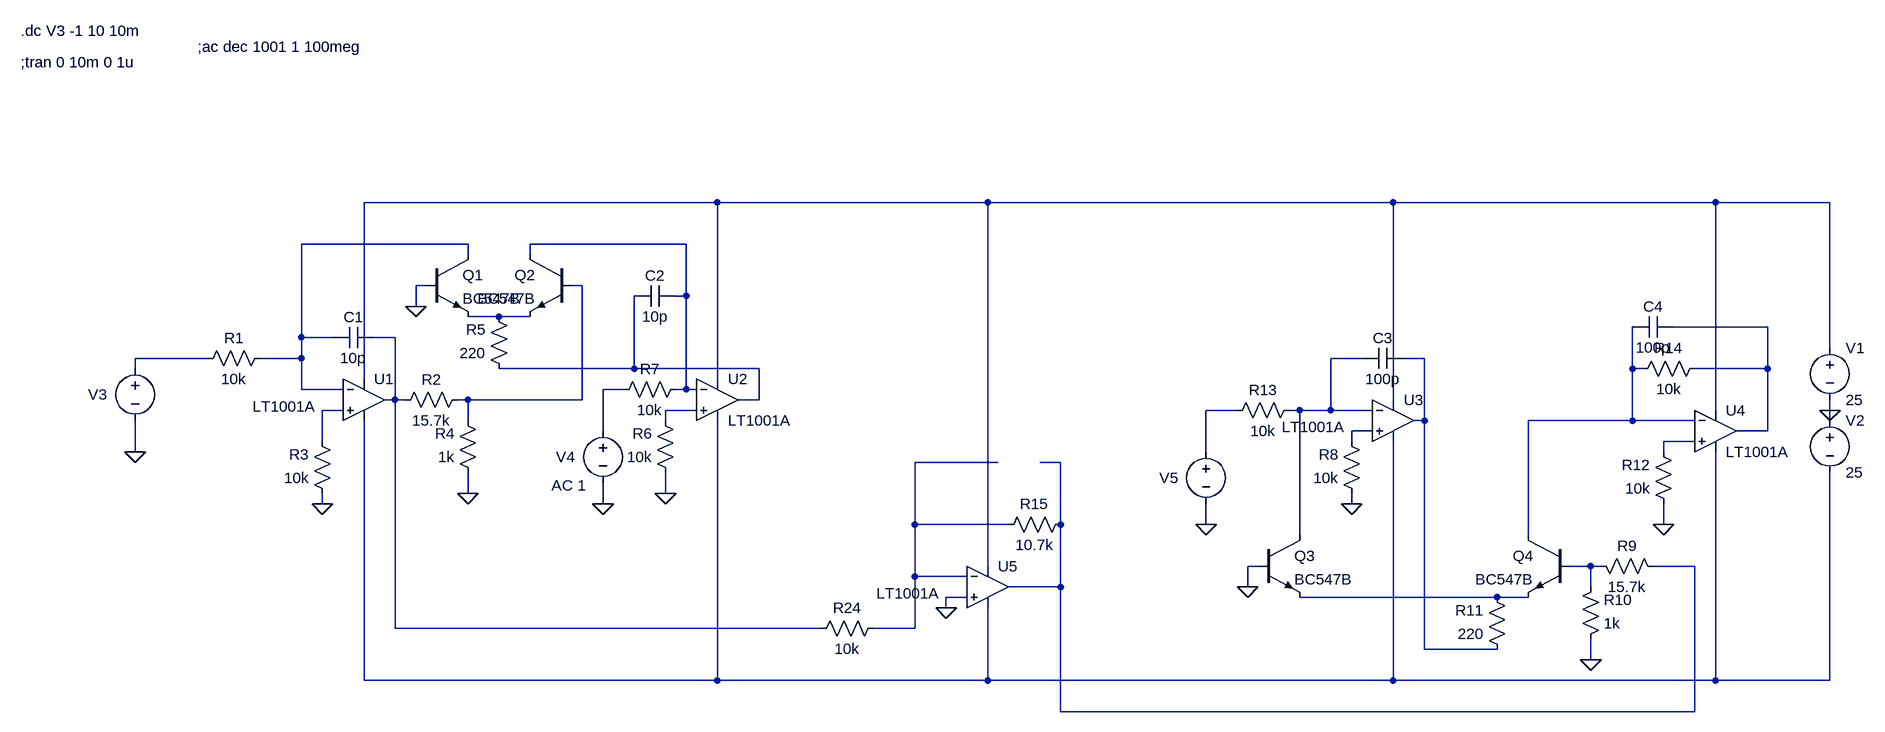
[diagram p0: schematic logTransistors.asc]
logTransistors.asc, the LTspice schematic file:
Version 4
SHEET 1 2636 680
WIRE 864 -192 320 -192
WIRE 1280 -192 864 -192
WIRE 1904 -192 1280 -192
WIRE 2400 -192 1904 -192
WIRE 2576 -192 2400 -192
WIRE 480 -128 224 -128
WIRE 816 -128 576 -128
WIRE 480 -112 480 -128
WIRE 576 -112 576 -128
WIRE 416 -64 400 -64
WIRE 656 -64 640 -64
WIRE 816 -48 816 -128
WIRE 816 -48 800 -48
WIRE 400 -32 400 -64
WIRE 528 -16 480 -16
WIRE 576 -16 528 -16
WIRE 2480 0 2336 0
WIRE 224 16 224 -128
WIRE 272 16 224 16
WIRE 368 16 336 16
WIRE 2576 32 2576 -192
WIRE 80 48 -32 48
WIRE 224 48 224 16
WIRE 224 48 160 48
WIRE 1856 48 1808 48
WIRE 1952 48 1920 48
WIRE -32 64 -32 48
WIRE 736 64 736 -48
WIRE 736 64 528 64
WIRE 928 64 736 64
WIRE 2272 64 2272 0
WIRE 2288 64 2272 64
WIRE 2480 64 2480 0
WIRE 2480 64 2368 64
WIRE 320 80 320 -192
WIRE 864 80 864 -192
WIRE 224 96 224 48
WIRE 288 96 224 96
WIRE 720 96 688 96
WIRE 816 96 816 -48
WIRE 816 96 800 96
WIRE 832 96 816 96
WIRE 368 112 368 16
WIRE 368 112 352 112
WIRE 384 112 368 112
WIRE 480 112 464 112
WIRE 656 112 656 -64
WIRE 656 112 480 112
WIRE 928 112 928 64
WIRE 928 112 896 112
WIRE 1904 112 1904 -192
WIRE 288 128 256 128
WIRE 832 128 784 128
WIRE 1664 128 1616 128
WIRE 1760 128 1744 128
WIRE 1808 128 1808 48
WIRE 1808 128 1760 128
WIRE 1872 128 1808 128
WIRE 2400 128 2400 -192
WIRE 2576 128 2576 112
WIRE 480 144 480 112
WIRE 784 144 784 128
WIRE 1952 144 1952 48
WIRE 1952 144 1936 144
WIRE 2272 144 2272 64
WIRE 2272 144 2112 144
WIRE 2368 144 2272 144
WIRE 2576 144 2576 128
WIRE 688 160 688 96
WIRE 1872 160 1840 160
WIRE 2480 160 2480 64
WIRE 2480 160 2432 160
WIRE 256 176 256 128
WIRE 1840 176 1840 160
WIRE 2368 176 2320 176
WIRE -32 192 -32 144
WIRE 1616 192 1616 128
WIRE 2320 192 2320 176
WIRE 1296 208 1168 208
WIRE 1392 208 1360 208
WIRE 480 256 480 224
WIRE 784 256 784 224
WIRE 256 272 256 256
WIRE 688 272 688 240
WIRE 1840 272 1840 256
WIRE 1168 304 1168 208
WIRE 1312 304 1168 304
WIRE 1392 304 1392 208
WIRE 1616 304 1616 272
WIRE 2320 304 2320 272
WIRE 1760 320 1760 128
WIRE 2112 320 2112 144
WIRE 1280 368 1280 -192
WIRE 1696 368 1680 368
WIRE 2208 368 2176 368
WIRE 2224 368 2208 368
WIRE 2368 368 2304 368
WIRE 1168 384 1168 304
WIRE 1248 384 1168 384
WIRE 1392 400 1392 304
WIRE 1392 400 1312 400
WIRE 1680 400 1680 368
WIRE 2208 400 2208 368
WIRE 1248 416 1216 416
WIRE 2064 416 1760 416
WIRE 2112 416 2064 416
WIRE 1216 432 1216 416
WIRE 368 464 368 112
WIRE 1024 464 368 464
WIRE 1168 464 1168 384
WIRE 1168 464 1104 464
WIRE 1952 496 1952 144
WIRE 2064 496 1952 496
WIRE 2208 512 2208 480
WIRE 320 544 320 144
WIRE 864 544 864 144
WIRE 864 544 320 544
WIRE 1280 544 1280 432
WIRE 1280 544 864 544
WIRE 1904 544 1904 176
WIRE 1904 544 1280 544
WIRE 2400 544 2400 192
WIRE 2400 544 1904 544
WIRE 2576 544 2576 224
WIRE 2576 544 2400 544
WIRE 1392 592 1392 400
WIRE 2368 592 2368 368
WIRE 2368 592 1392 592
FLAG -32 192 0
FLAG 256 272 0
FLAG 2576 128 0
FLAG 480 256 0
FLAG 784 256 0
FLAG 688 272 0
FLAG 400 -32 0
FLAG 1840 272 0
FLAG 2208 512 0
FLAG 2320 304 0
FLAG 1616 304 0
FLAG 1680 400 0
FLAG 1216 432 0
SYMBOL res 272 272 R180
WINDOW 0 36 76 Left 2
WINDOW 3 36 40 Left 2
SYMATTR InstName R3
SYMATTR Value 10k
SYMBOL voltage 2576 16 R0
WINDOW 123 0 0 Left 2
WINDOW 39 0 0 Left 2
SYMATTR InstName V1
SYMATTR Value 25
SYMBOL voltage 2576 128 R0
WINDOW 123 0 0 Left 2
WINDOW 39 0 0 Left 2
SYMATTR InstName V2
SYMATTR Value 25
SYMBOL Opamps\\LT1001A 320 48 R0
WINDOW 3 -171 74 Left 2
SYMATTR InstName U1
SYMBOL voltage -32 48 R0
WINDOW 0 -72 56 Left 2
WINDOW 3 -301 -26 Invisible 2
WINDOW 123 -79 100 Left 2
WINDOW 39 0 0 Left 2
SYMATTR InstName V3
SYMATTR Value 1
SYMBOL res 176 32 R90
WINDOW 0 0 56 VBottom 2
WINDOW 3 32 56 VTop 2
SYMATTR InstName R1
SYMATTR Value 10k
SYMBOL Opamps\\LT1001A 864 48 R0
SYMATTR InstName U2
SYMBOL npn 416 -112 R0
SYMATTR InstName Q1
SYMATTR Value BC547B
SYMBOL res 480 96 R90
WINDOW 0 0 56 VBottom 2
WINDOW 3 32 56 VTop 2
SYMATTR InstName R2
SYMATTR Value 15.7k
SYMBOL res 496 240 R180
WINDOW 0 36 76 Left 2
WINDOW 3 36 40 Left 2
SYMATTR InstName R4
SYMATTR Value 1k
SYMBOL npn 640 -112 M0
SYMATTR InstName Q2
SYMATTR Value BC547B
SYMBOL res 544 80 R180
WINDOW 0 36 76 Left 2
WINDOW 3 36 40 Left 2
SYMATTR InstName R5
SYMATTR Value 220
SYMBOL res 800 240 R180
WINDOW 0 36 76 Left 2
WINDOW 3 36 40 Left 2
SYMATTR InstName R6
SYMATTR Value 10k
SYMBOL voltage 688 144 R0
WINDOW 0 -72 56 Left 2
WINDOW 3 -301 -26 Invisible 2
WINDOW 123 -79 100 Left 2
WINDOW 39 0 0 Left 2
SYMATTR InstName V4
SYMATTR Value 1
SYMATTR Value2 AC 1
SYMBOL res 816 80 R90
WINDOW 0 0 56 VBottom 2
WINDOW 3 32 56 VTop 2
SYMATTR InstName R7
SYMATTR Value 10k
SYMBOL cap 336 0 R90
WINDOW 0 0 32 VBottom 2
WINDOW 3 32 32 VTop 2
SYMATTR InstName C1
SYMATTR Value 10p
SYMBOL cap 800 -64 R90
WINDOW 0 0 32 VBottom 2
WINDOW 3 32 32 VTop 2
SYMATTR InstName C2
SYMATTR Value 10p
SYMBOL res 1856 272 R180
WINDOW 0 36 76 Left 2
WINDOW 3 36 40 Left 2
SYMATTR InstName R8
SYMATTR Value 10k
SYMBOL Opamps\\LT1001A 1904 80 R0
WINDOW 3 -171 74 Left 2
SYMATTR InstName U3
SYMBOL Opamps\\LT1001A 2400 96 R0
SYMATTR InstName U4
SYMBOL npn 1696 320 R0
SYMATTR InstName Q3
SYMATTR Value BC547B
SYMBOL res 2208 352 M90
WINDOW 0 0 56 VBottom 2
WINDOW 3 32 56 VTop 2
SYMATTR InstName R9
SYMATTR Value 15.7k
SYMBOL res 2192 496 M180
WINDOW 0 36 76 Left 2
WINDOW 3 36 40 Left 2
SYMATTR InstName R10
SYMATTR Value 1k
SYMBOL npn 2176 320 M0
SYMATTR InstName Q4
SYMATTR Value BC547B
SYMBOL res 2080 512 R180
WINDOW 0 36 76 Left 2
WINDOW 3 36 40 Left 2
SYMATTR InstName R11
SYMATTR Value 220
SYMBOL res 2336 288 R180
WINDOW 0 36 76 Left 2
WINDOW 3 36 40 Left 2
SYMATTR InstName R12
SYMATTR Value 10k
SYMBOL voltage 1616 176 R0
WINDOW 0 -72 56 Left 2
WINDOW 3 -301 -26 Invisible 2
WINDOW 123 -79 100 Left 2
WINDOW 39 0 0 Left 2
SYMATTR InstName V5
SYMATTR Value 1
SYMBOL res 1760 112 R90
WINDOW 0 0 56 VBottom 2
WINDOW 3 32 56 VTop 2
SYMATTR InstName R13
SYMATTR Value 10k
SYMBOL cap 1920 32 R90
WINDOW 0 0 32 VBottom 2
WINDOW 3 32 32 VTop 2
SYMATTR InstName C3
SYMATTR Value 100p
SYMBOL cap 2336 -16 R90
WINDOW 0 0 32 VBottom 2
WINDOW 3 32 32 VTop 2
SYMATTR InstName C4
SYMATTR Value 100p
SYMBOL res 2384 48 R90
WINDOW 0 0 56 VBottom 2
WINDOW 3 32 56 VTop 2
SYMATTR InstName R14
SYMATTR Value 10k
SYMBOL Opamps\\LT1001A 1280 336 R0
WINDOW 3 -171 74 Left 2
SYMATTR InstName U5
SYMBOL res 1408 288 R90
WINDOW 0 0 56 VBottom 2
WINDOW 3 32 56 VTop 2
SYMATTR InstName R15
SYMATTR Value 10.7k
SYMBOL res 1120 448 R90
WINDOW 0 0 56 VBottom 2
WINDOW 3 32 56 VTop 2
SYMATTR InstName R24
SYMATTR Value 10k
TEXT -208 -456 Left 2 !.dc V3 -1 10 10m
TEXT -208 -408 Left 2 !;tran 0 10m 0 1u
TEXT 64 -432 Left 2 !;ac dec 1001 1 100meg

The netlist it stands for:
* logTransistors.asc
R3 0 N014 10k
V1 N001 0 25
V2 0 N023 25
XU1 N014 N002 N001 N023 N007 LT1001  ; LT1001A, pins In+ In- V+ V- OUT
V3 N008 0 1
R1 N002 N008 10k
XU2 N015 N003 N001 N023 N011 LT1001  ; LT1001A, pins In+ In- V+ V- OUT
Q1 N002 0 N005 0 BC547B
R2 N004 N007 15.7k
R4 0 N004 1k
Q2 N003 N004 N005 0 BC547B
R5 N011 N005 220
R6 0 N015 10k
V4 N013 0 1 AC 1
R7 N003 N013 10k
C1 N007 N002 10p
C2 N003 N011 10p
R8 0 N017 10k
XU3 N017 N009 N001 N023 N010 LT1001  ; LT1001A, pins In+ In- V+ V- OUT
XU4 N018 N012 N001 N023 N006 LT1001  ; LT1001A, pins In+ In- V+ V- OUT
Q3 N009 0 N022 0 BC547B
R9 N021 N020 15.7k
R10 0 N021 1k
Q4 N012 N021 N022 0 BC547B
R11 N010 N022 220
R12 0 N018 10k
V5 N016 0 1
R13 N009 N016 10k
C3 N010 N009 100p
C4 N006 N012 100p
R14 N006 N012 10k
XU5 0 N019 N001 N023 N020 LT1001  ; LT1001A, pins In+ In- V+ V- OUT
R15 N020 N019 10.7k
R24 N019 N007 10k
.model NPN NPN
.model PNP PNP
.lib standard.bjt
.dc V3 -1 10 10m
;tran 0 10m 0 1u
;ac dec 1001 1 100meg
.lib LTC.lib
.backanno
.end